# EAGLE design Power Supply board (EAGLE 9.6.2)
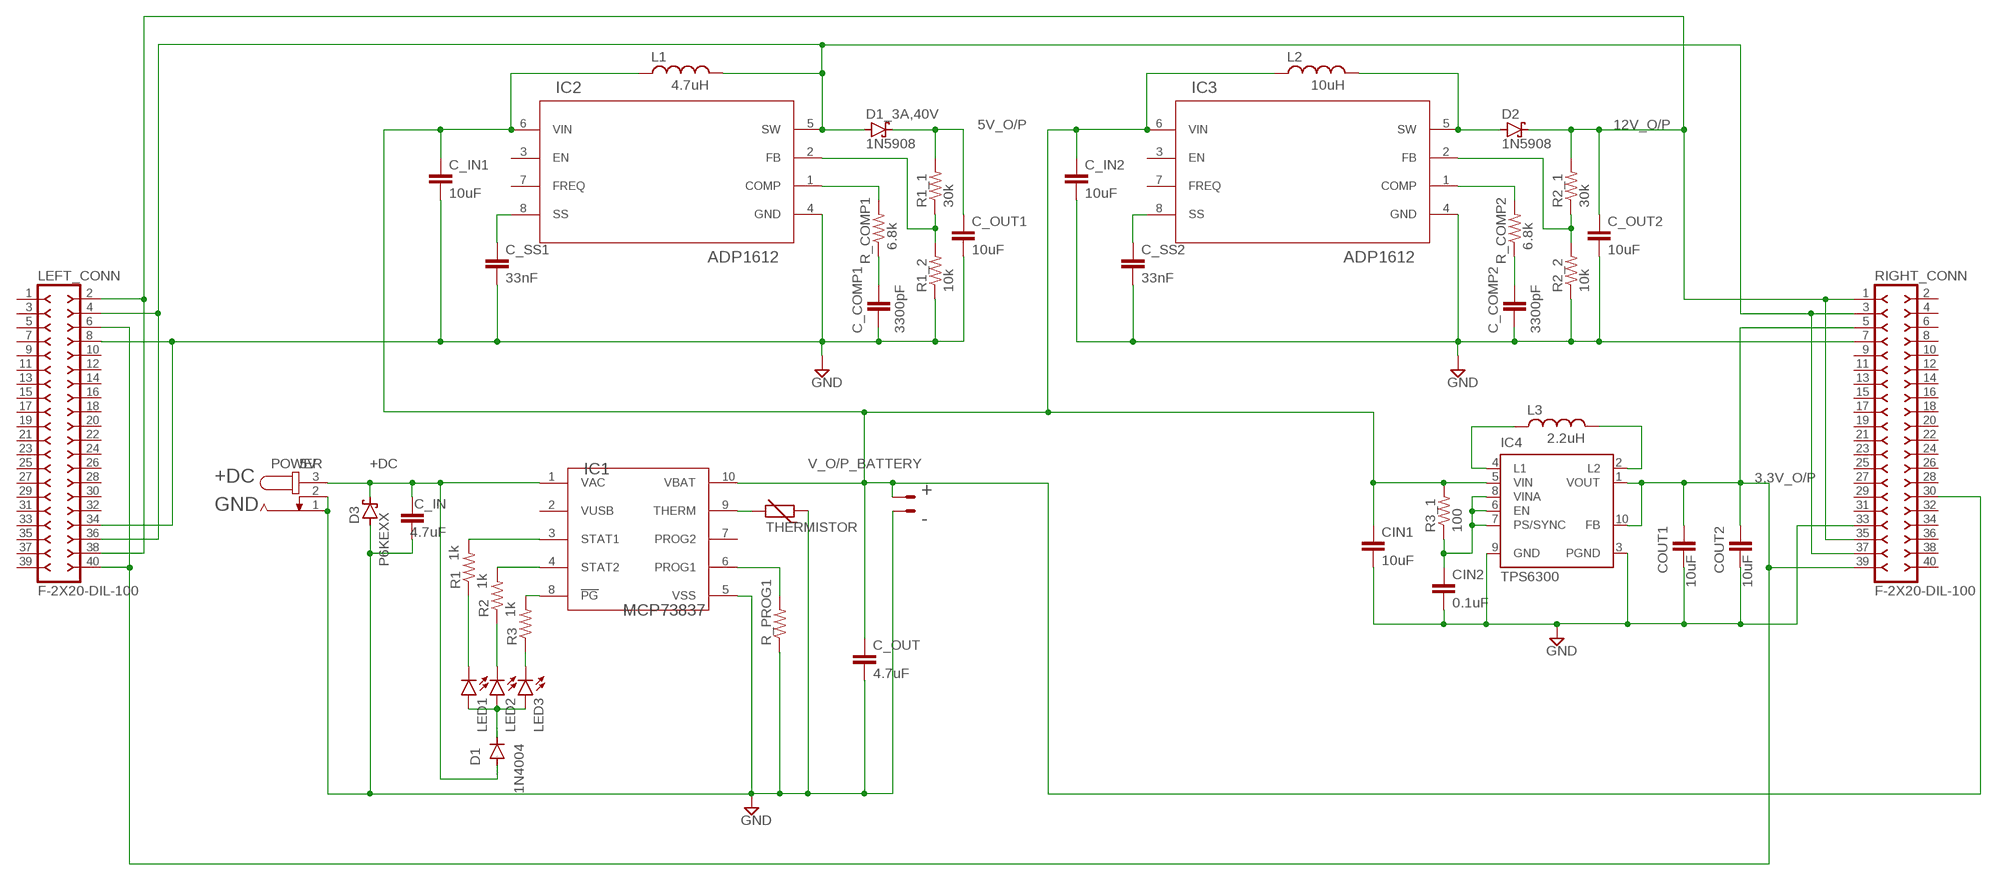
[diagram p0: schematic, sheet 1]

## Parts
BATT-CHARGING  JST-XH-02-PIN-ROUND-PAD  [JST-XH-02-PACKAGE-ROUND-PAD]
C_COMP1  3300pF  C-EU025-024X044  [C025-024X044]
C_COMP2  3300pF  C-EU025-024X044  [C025-024X044]
C_IN  4.7uF  C-EU025-024X044  [C025-024X044]
C_IN1  10uF  C-EU025-024X044  [C025-024X044]
C_IN2  10uF  C-EU025-024X044  [C025-024X044]
C_OUT  4.7uF  C-EU025-024X044  [C025-024X044]
C_OUT1  10uF  C-EU025-024X044  [C025-024X044]
C_OUT2  10uF  C-EU025-024X044  [C025-024X044]
C_SS1  33nF  C-EU025-024X044  [C025-024X044]
C_SS2  33nF  C-EU025-024X044  [C025-024X044]
CIN1  10uF  C-EU025-024X044  [C025-024X044]
CIN2  0.1uF  C-EU025-024X044  [C025-024X044]
COUT1  10uF  C-EU025-024X044  [C025-024X044]
COUT2  10uF  C-EU025-024X044  [C025-024X044]
D1  1N4004  [DO41-10]
D1_3A,40V  1N5908  [C4111-15]
D2  1N5908  [C4111-15]
D3  P6KEXX  [CB417-15]
IC1  MCP73837  MCP73837-FCI/UN  [MSOP10_MC_MCH]
IC2  ADP1612  [RM_8_ADI]
IC3  ADP1612  [RM_8_ADI]
IC4  TPS6300  [DRC-S-PVSON-N10]
L1  4.7uH  L-US0204/7  [0204/7]
L2  10uH  L-US0204/7  [0204/7]
L3  2.2uH  L-US0204/7  [0204/7]
LED1  LED3MM  [LED3MM]
LED2  LED3MM  [LED3MM]
LED3  LED3MM  [LED3MM]
LEFT_CONN  F-2X20-DIL-100  [DIL-100-2X20]
POWER  5V  JACK-PLUG0  [SPC4077]
R1  1k  R-US_0204/7  [0204/7]
R1_1  30k  R-US_0204/7  [0204/7]
R1_2  10k  R-US_0204/7  [0204/7]
R2  1k  R-US_0204/7  [0204/7]
R2_1  30k  R-US_0204/7  [0204/7]
R2_2  10k  R-US_0204/7  [0204/7]
R3  1k  R-US_0204/7  [0204/7]
R3_1  100  R-US_0204/7  [0204/7]
R_COMP1  6.8k  R-US_0204/7  [0204/7]
R_COMP2  6.8k  R-US_0204/7  [0204/7]
R_PROG1  R-US_0204/7  [0204/7]
RIGHT_CONN  F-2X20-DIL-100  [DIL-100-2X20]
THERMISTOR  THERMISTOR-5  [R-5]

## Nets
3.3V_O/P: COUT1.1 COUT2.1 IC4.1(VOUT) IC4.10(FB) LEFT_CONN.6 LEFT_CONN.40 RIGHT_CONN.5 RIGHT_CONN.39
5V_O/P: C_OUT1.1 D1_3A,40V.C R1_1.2
12V_O/P: C_OUT2.1 D2.C LEFT_CONN.2 LEFT_CONN.38 R2_1.2 RIGHT_CONN.1 RIGHT_CONN.35
+DC: C_IN.1 D1.A D3.C IC1.1(VAC) POWER.3
GND: BATT-CHARGING.2 C_COMP1.2 C_COMP2.2 C_IN1.2 C_IN2.2 C_IN.2 C_OUT1.2 C_OUT2.2 C_OUT.2 C_SS1.2 C_SS2.2 CIN1.2 CIN2.2 COUT1.2 COUT2.2 D3.A IC1.5(VSS) IC2.4(GND) IC3.4(GND) IC4.3(PGND) IC4.9(GND) LEFT_CONN.8 LEFT_CONN.34 POWER.1 POWER.2 R1_2.1 R2_2.1 R_PROG1.1 RIGHT_CONN.7 RIGHT_CONN.33 THERMISTOR.1
N$1: IC4.4(L1) L3.1
N$2: D1_3A,40V.A IC2.5(SW) L1.2 LEFT_CONN.4 LEFT_CONN.36 RIGHT_CONN.3 RIGHT_CONN.37
N$4: IC2.2(FB) R1_1.1 R1_2.2
N$5: IC2.1(COMP) R_COMP1.2
N$6: C_COMP1.1 R_COMP1.1
N$7: IC4.2(L2) L3.2
N$8: D2.A IC3.5(SW) L2.2
N$9: IC1.6(PROG1) R_PROG1.2
N$10: IC3.2(FB) R2_1.1 R2_2.2
N$11: C_SS1.1 IC2.8(SS)
N$12: IC3.1(COMP) R_COMP2.2
N$13: C_COMP2.1 R_COMP2.1
N$14: C_SS2.1 IC3.8(SS)
N$15: IC1.3(STAT1) R1.2
N$16: IC1.4(STAT2) R2.2
N$17: CIN2.1 IC4.6(EN) IC4.7(PS/SYNC) IC4.8(VINA) R3_1.1
N$18: IC1.8(!PG) R3.2
N$19: D1.C LED1.A LED2.A LED3.A
N$20: LED1.K(C) R1.1
N$21: LED2.K(C) R2.1
N$22: LED3.K(C) R3.1
N$24: IC1.9(THERM) THERMISTOR.2
V_O/P_BATTERY: BATT-CHARGING.1 C_IN1.1 C_IN2.1 C_OUT.1 CIN1.1 IC1.10(VBAT) IC2.6(VIN) IC3.6(VIN) IC4.5(VIN) L1.1 L2.1 R3_1.2 RIGHT_CONN.30
Unconnected: IC1.2(VUSB) IC1.7(PROG2) IC2.3(EN) IC2.7(FREQ) IC3.3(EN) IC3.7(FREQ) IC4.TH LEFT_CONN.1 LEFT_CONN.3 LEFT_CONN.5 LEFT_CONN.7 LEFT_CONN.9 LEFT_CONN.10 LEFT_CONN.11 LEFT_CONN.12 LEFT_CONN.13 LEFT_CONN.14 LEFT_CONN.15 LEFT_CONN.16 LEFT_CONN.17 LEFT_CONN.18 LEFT_CONN.19 LEFT_CONN.20 LEFT_CONN.21 LEFT_CONN.22 LEFT_CONN.23 LEFT_CONN.24 LEFT_CONN.25 LEFT_CONN.26 LEFT_CONN.27 LEFT_CONN.28 LEFT_CONN.29 LEFT_CONN.30 LEFT_CONN.31 LEFT_CONN.32 LEFT_CONN.33 LEFT_CONN.35 LEFT_CONN.37 LEFT_CONN.39 RIGHT_CONN.2 RIGHT_CONN.4 RIGHT_CONN.6 RIGHT_CONN.8 RIGHT_CONN.9 RIGHT_CONN.10 RIGHT_CONN.11 RIGHT_CONN.12 RIGHT_CONN.13 RIGHT_CONN.14 RIGHT_CONN.15 RIGHT_CONN.16 RIGHT_CONN.17 RIGHT_CONN.18 RIGHT_CONN.19 RIGHT_CONN.20 RIGHT_CONN.21 RIGHT_CONN.22 RIGHT_CONN.23 RIGHT_CONN.24 RIGHT_CONN.25 RIGHT_CONN.26 RIGHT_CONN.27 RIGHT_CONN.28 RIGHT_CONN.29 RIGHT_CONN.31 RIGHT_CONN.32 RIGHT_CONN.34 RIGHT_CONN.36 RIGHT_CONN.38 RIGHT_CONN.40

## Notes on the sheet
- +
- -

## Library data of the parts
BATT-CHARGING = Rembrandt Electronics - JST XH Connectors v1-0:JST-XH-02-PIN: JST XH Connector 2 Pin Wire to board connector. Pitch: 2,54 mm, (0.100") Number of pins: 2 Created by Rembrandt Electronics www.rembrandtelectronics.com
C_COMP1 C_COMP2 C_IN C_IN1 C_IN2 C_OUT C_OUT1 C_OUT2 C_SS1 C_SS2 CIN1 CIN2 COUT1 COUT2 = rcl:C-EU: CAPACITOR, European symbol; SPICEPREFIX: C
D1 = diode:1N4004: DIODE general purpose rectifier, 1 A
D1_3A,40V D2 = diode:1N5908: DIODE schottky
D3 = diode:P6KEXX: DIODE transient-voltage suppressor
IC1 = ultra librarian:MCP73837-FCI/UN: MCP73837 Battery charge controller , MCP 73837 - Li-Ion/Li-Polymer Battery Charge Management Controller; BUILT_BY: EMA_UL_Team; MANUFACTURER_PART_NUMBER: MCP73837-FCI/UN; SOURCELIBRARY: Microchip_2011-05-13; VENDOR: Microchip
IC2 IC3 = ultra librarian:ADP1612: ADP 1612/1613 , ADP 1612, ADP1613, DC - DC step up converter; BUILT_BY: EMA_UL_Team; MANUFACTURER_PART_NUMBER: ADP1612ARMZ-R7; SOURCELIBRARY: Analog_2015-12-15; VENDOR: Analog Devices Inc
IC4 = texas:TPS6300*: HIGH EFFICIENT SINGLE INDUCTOR BUCK-BOOST CONVERTER WITH 1.8-A SWITCHES Source: http://focus.ti.com/lit/ds/symlink/tps63001.pdf; MPN: TPS63000DRCTG4; OC_FARNELL: 1511852; OC_NEWARK: 59M7217
L1-L3 = rcl:L-US: INDUCTOR, American symbol; SPICEPREFIX: L
LED1-LED3 = led:LED: LED OSRAM: - CHIPLED LG R971, LG N971, LY N971, LG Q971, LY Q971, LO R971, LY R971 LH N974, LH R974 LS Q976, LO Q976, LY Q976 LO Q996 - Hyper CHIPLED LW Q18S LB Q993, LB Q99A, LB R99A - SideLED LS A670, LO A670, LY A670, LG A670, LP A670 LB A673, LV A673, LT A673, LW A673 LH A674 LY A675 LS A676, LA A676, LO A676, LY A676, LW A676 LS A679, LY A679, LG A679 - Hyper Micro SIDELED® LS Y876, LA Y876, LO Y876, LY Y876 LT Y87S - SmartLED LW L88C, LW L88S LB L89C, LB L89S, LG L890 LS L89K, LO L89K, LY L89K LS L896, LA L896, LO L896, LY L896 - TOPLED LS T670, LO T670, LY T670, LG T670, LP T670 LSG T670, LSP T670, LSY T670, LOP T670, LYG T670 LG T671, LOG T671, LSG T671 LB T673, LV T673, LT T673, LW T673 LH T674 LS T676, LA T676, LO T676, LY T676, LB T676, LH T676, LSB T676, LW T676 LB T67C, LV T67C, LT T67C, LS T67K, LO T67K, LY T67K, LW E67C LS E67B, LA E67B, LO E67B, LY E67B, LB E67C, LV E67C, LT E67C LW T67C LS T679, LY T679, LG T679 LS T770, LO T770, LY T770, LG T770, LP T770 LB T773, LV T773, LT T773, LW T773 LH T774 LS E675, LA E675, LY E675, LS T675 LS T776, LA T776, LO T776, LY T776, LB T776 LHGB T686 LT T68C, LB T68C - Hyper Mini TOPLED® LB M676 - Mini TOPLED Santana® LG M470 LS M47K, LO M47K, LY M47K Source: http://www.osram.convergy.de LUXEON: - LUMILED® LXK2-PW12-R00, LXK2-PW12-S00, LXK2-PW14-U00, LXK2-PW14-V00 LXK2-PM12-R00, LXK2-PM12-S00, LXK2-PM14-U00 LXK2-PE12-Q00, LXK2-PE12-R00, LXK2-PE12-S00, LXK2-PE14-T00, LXK2-PE14-U00 LXK2-PB12-K00, LXK2-PB12-L00, LXK2-PB12-M00, LXK2-PB14-N00, LXK2-PB14-P00, LXK2-PB14-Q00 LXK2-PR12-L00, LXK2-PR12-M00, LXK2-PR14-Q00, LXK2-PR14-R00 LXK2-PD12-Q00, LXK2-PD12-R00, LXK2-PD12-S00 LXK2-PH12-R00, LXK2-PH12-S00 LXK2-PL12-P00, LXK2-PL12-Q00, LXK2-PL12-R00 Source: www.luxeon.com KINGBRIGHT: KA-3528ASYC Source: www.kingbright.com
LEFT_CONN RIGHT_CONN = con-headers-jp:F-2X20-: FEMALE HEADER
POWER = con-jack:JACK-PLUG: DC POWER JACK Power Jack, DC, Right Angle, Through Hole, Rated 5A at 16VDC, PC Terminals Distributor: Farnell (www.Farnell.de) Drawing: 84N1161.pdf / 84N1162.pdf Manufacturer: SPC Technology (www.spctechnology.com) Type: SPC4077 / SPC 4078; OC_FARNELL: unknown; OC_NEWARK: unknown
R1 R1_1 R1_2 R2 R2_1 R2_2 R3 R3_1 R_COMP1 R_COMP2 R_PROG1 = resistor:R-US_: RESISTOR, American symbol
THERMISTOR = varistor:THERMISTOR: THERMISTOR

## Board
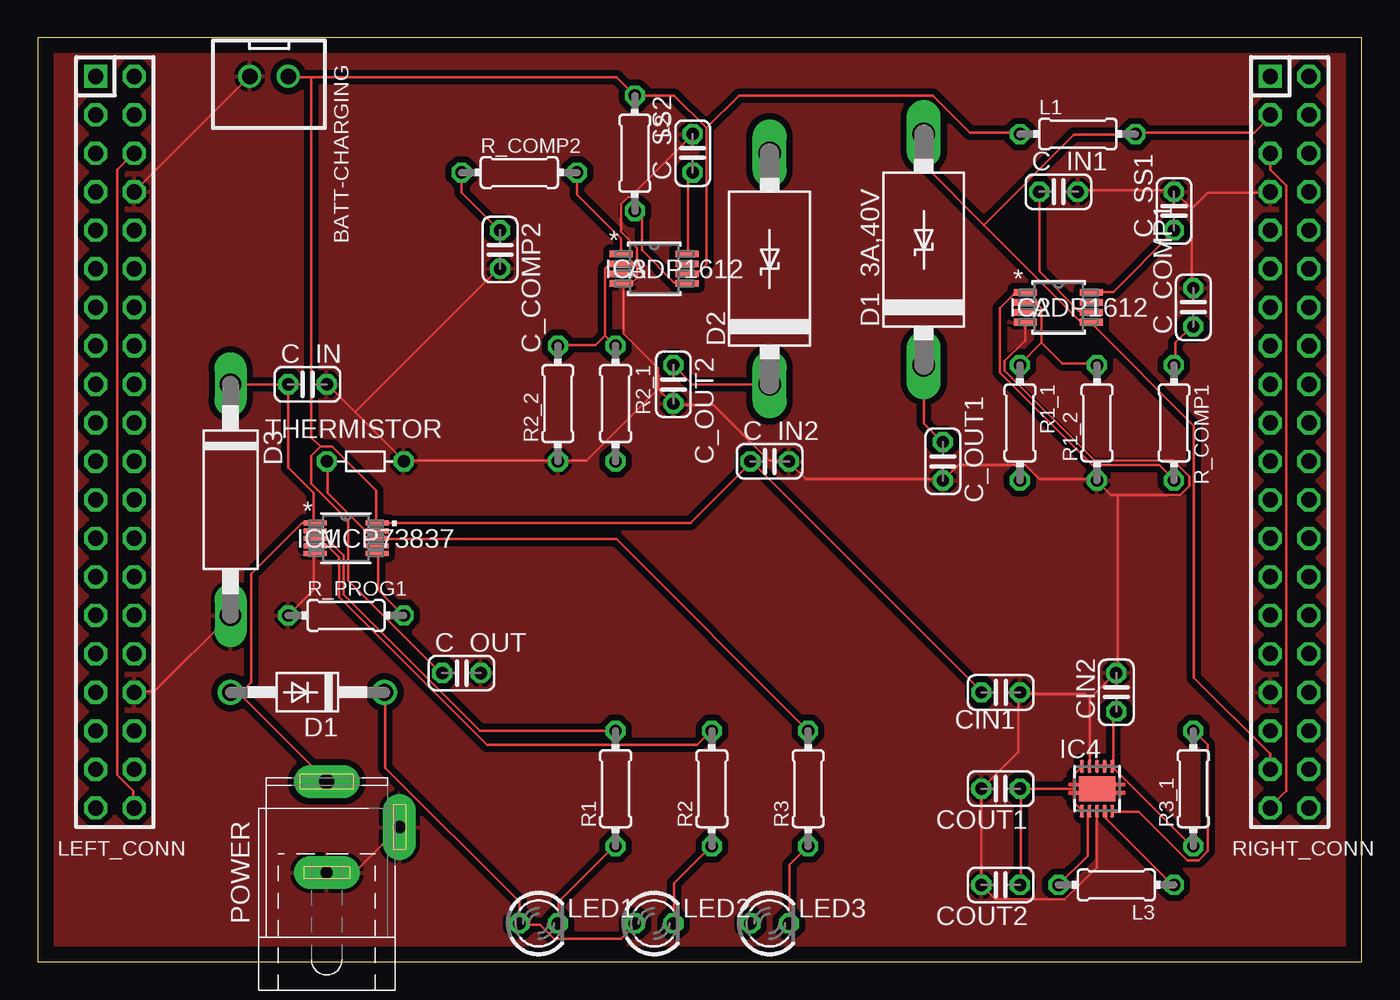
[diagram p1: board, top side]
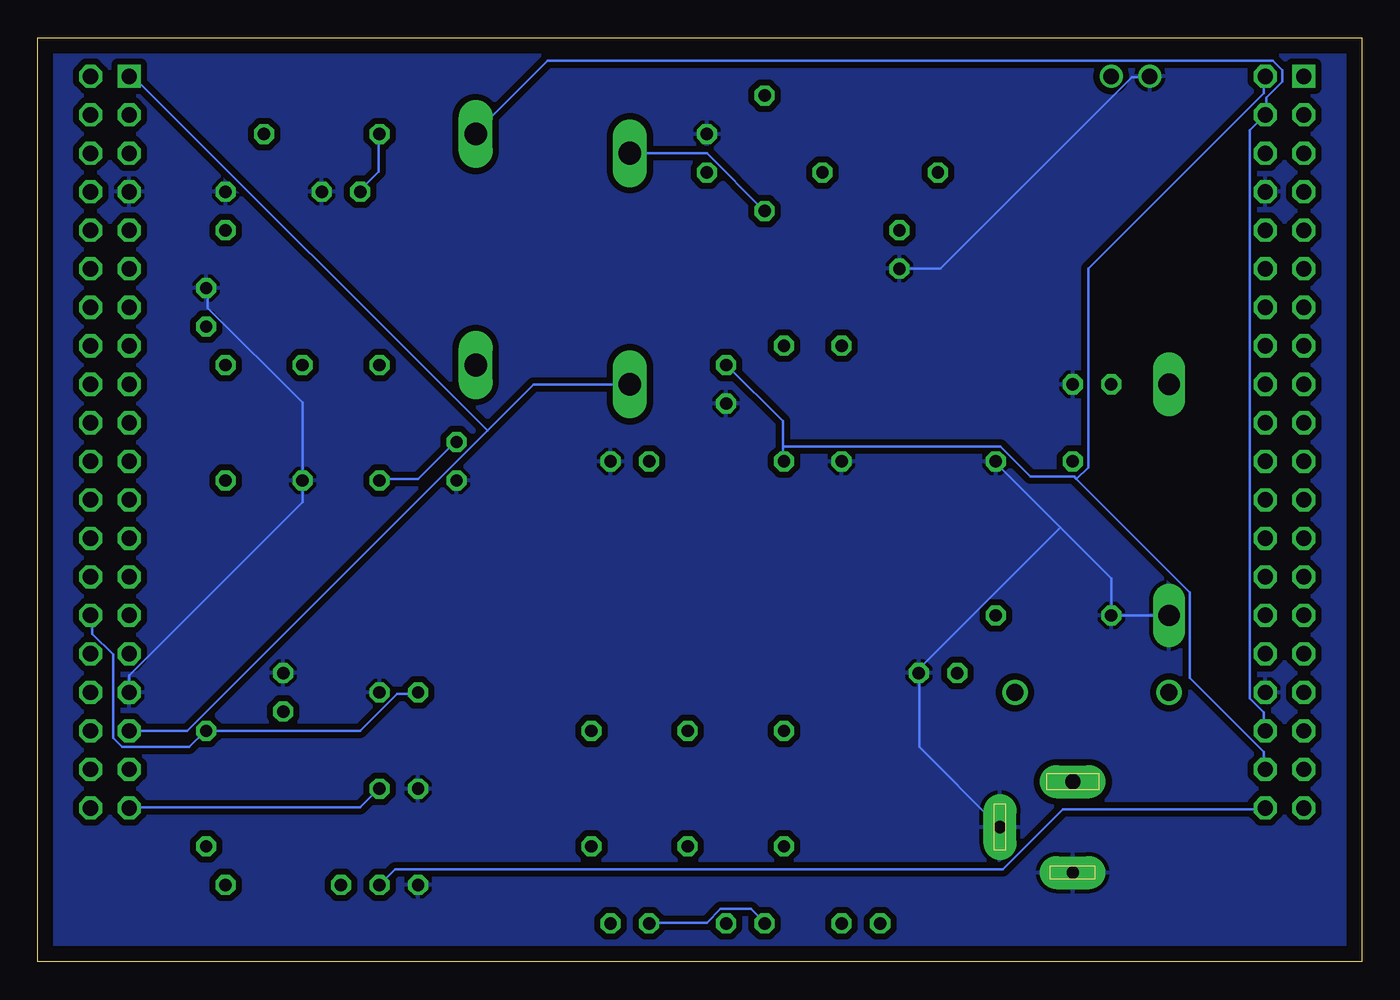
[diagram p2: board, bottom side, seen from below]

Size 87.3 x 60.95 mm. Coordinates in mm from the lower left corner, seen from the top.
Outline: 0,0 87.3,0 87.3,60.95 0,60.95 0,0
Copper layers (1*16): Top 0.035mm / dielectric 1.5mm / Bottom 0.035mm
Design rules "default": minimum track width 6mil, minimum drill 0.35mm, track to track 6mil, track to pad 6mil, pad to pad 6mil, via to via 6mil, smd to smd 6mil, copper to edge 40mil, drill to drill 6mil, minimum pad ring 10mil, minimum via ring 8mil, stop-mask expansion 4mil, vias tented up to drill 0mil, thermal gap 10mil

### Footprints (pad centres in the part's own frame; a part is rotated, then mirrored left to right if it is on the bottom)
JST-XH-02-PACKAGE-ROUND-PAD = drill 1.016: 1 -1.27,0; 2 1.27,0
C025-024X044 = drill 0.813 octagon: 1 -1.27,0; 2 1.27,0
DO41-10 = drill 1.118: A 5.08,0; C -5.08,0
C4111-15 = drill 1.499 long: A 7.62,0; C -7.62,0
CB417-15 = drill 1.397 long: A 7.62,0; C -7.62,0
MSOP10_MC_MCH = smd 1.524 x 0.33: 1 -2.045,1; 2 -2.045,0.5; 3 -2.045,0; 4 -2.045,-0.5; 5 -2.045,-1; 6 2.045,-1; 7 2.045,-0.5; 8 2.045,0; 9 2.045,0.5; 10 2.045,1
RM_8_ADI = smd 1.524 x 0.432: 1 -2.172,0.975; 2 -2.172,0.325; 3 -2.172,-0.325; 4 -2.172,-0.975; 5 2.172,-0.975; 6 2.172,-0.325; 7 2.172,0.325; 8 2.172,0.975
DRC-S-PVSON-N10 = smd 0.28 x 0.85: 1 -1,-1.475; 2 -0.5,-1.475; 3 0,-1.475; 4 0.5,-1.475; 5 1,-1.475; 6 1,1.475; 7 0.5,1.475; 8 0,1.475; 9 -0.5,1.475; 10 -1,1.475 | smd 2.4 x 1.65: TH 0,0
0204/7 = drill 0.813 octagon: 1 -3.81,0; 2 3.81,0
LED3MM = drill 0.813 octagon: A -1.27,0; K 1.27,0
DIL-100-2X20 = drill 1.016 square: 1 -24.13,-1.27 | drill 1.016 octagon: 2 -24.13,1.27; 3 -21.59,-1.27; 4 -21.59,1.27; 5 -19.05,-1.27; 6 -19.05,1.27; 7 -16.51,-1.27; 8 -16.51,1.27; 9 -13.97,-1.27; 10 -13.97,1.27; 11 -11.43,-1.27; 12 -11.43,1.27; 13 -8.89,-1.27; 14 -8.89,1.27; 15 -6.35,-1.27; 16 -6.35,1.27; 17 -3.81,-1.27; 18 -3.81,1.27; 19 -1.27,-1.27; 20 -1.27,1.27; 21 1.27,-1.27; 22 1.27,1.27; 23 3.81,-1.27; 24 3.81,1.27; 25 6.35,-1.27; 26 6.35,1.27; 27 8.89,-1.27; 28 8.89,1.27; 29 11.43,-1.27; 30 11.43,1.27; 31 13.97,-1.27; 32 13.97,1.27; 33 16.51,-1.27; 34 16.51,1.27; 35 19.05,-1.27; 36 19.05,1.27; 37 21.59,-1.27; 38 21.59,1.27; 39 24.13,-1.27; 40 24.13,1.27
SPC4077 = drill 0.8 pad 2.184 long: 1 -3,0; 2 0,-4.8 | drill 1 pad 2.184 long: 3 3,0
R-5 = drill 0.813 octagon: 1 -2.54,0; 2 2.54,0

### Placement (x,y rotation side)
BATT-CHARGING  15.24,58.42 180 top
C_COMP1  76.2,43.18 90 top
C_COMP2  30.48,46.99 270 top
C_IN  17.78,38.1 0 top
C_IN1  67.31,50.8 0 top
C_IN2  48.26,33.02 0 top
C_OUT  27.94,19.05 0 top
C_OUT1  59.69,33.02 270 top
C_OUT2  41.91,38.1 270 top
C_SS1  74.93,49.53 90 top
C_SS2  43.18,53.34 90 top
CIN1  63.5,17.78 0 top
CIN2  71.12,17.78 90 top
COUT1  63.5,11.43 180 top
COUT2  63.5,5.08 180 top
D1  17.78,17.78 180 top
D1_3A,40V  58.42,46.99 90 top
D2  48.26,45.72 90 top
D3  12.7,30.48 270 top
IC1  20.32,27.94 0 top
IC2  67.31,43.18 0 top
IC3  40.64,45.72 0 top
IC4  69.85,11.43 0 top
L1  68.58,54.61 0 top
L2  39.37,53.34 270 top
L3  71.12,5.08 180 top
LED1  33.02,2.54 0 top
LED2  40.64,2.54 0 top
LED3  48.26,2.54 0 top
LEFT_CONN  5.08,34.29 270 top
POWER  19.05,8.89 90 top
R1  38.1,11.43 90 top
R1_1  64.77,35.56 270 top
R1_2  69.85,35.56 90 top
R2  44.45,11.43 90 top
R2_1  38.1,36.83 270 top
R2_2  34.29,36.83 90 top
R3  50.8,11.43 90 top
R3_1  76.2,11.43 90 top
R_COMP1  74.93,35.56 270 top
R_COMP2  31.75,52.07 0 top
R_PROG1  20.32,22.86 0 top
RIGHT_CONN  82.55,34.29 270 top
THERMISTOR  21.59,33.02 180 top

### Tracks (layer width: path | path; a pad name or v marks a point on that pad's centre or on a via)
3.3V_O/P
  Top 0.152: LEFT_CONN.40 6.3,10.21 6.3,11.28 5.23,12.34 5.23,52.27 6.3,53.34 LEFT_CONN.6 | 68.33,11.43 68.33,12.34 68.78,12.8 IC4.10 | 68.33,11.43 68.33,10.52 68.78,10.06 IC4.1 | 64.82,11.43 68.33,11.43 | 64.82,11.43 64.82,5.18 COUT2.1 | 64.82,11.43 COUT1.1 | RIGHT_CONN.5 81.28,52.27 82.35,51.21 82.35,11.28 81.28,10.21 RIGHT_CONN.39
  Bottom 0.152: RIGHT_CONN.39 81.28,10.21 66.04,10.21 64.82,11.43 COUT1.1 | COUT2.1 63.75,6.1 23.67,6.1 19.71,10.06 6.45,10.06 LEFT_CONN.40
5V_O/P
  Top 0.152: D1_3A,40V.C 58.42,35.51 59.64,34.29 C_OUT1.1
  Bottom 0.152: R1_1.2 64.67,31.85 62.23,31.85 59.79,34.29 C_OUT1.1
12V_O/P
  Top 0.152: D2.C 43.18,38.1 C_OUT2.1
  Bottom 0.152: RIGHT_CONN.35 77.47,15.24 57.66,35.05 | 57.66,35.05 54.61,38.1 D2.C | 57.66,35.05 80.98,58.37 81.28,58.37 RIGHT_CONN.1 | 38.15,33.98 38.15,35.66 41.81,39.32 C_OUT2.1 | 38.15,33.98 38.15,33.07 R2_1.2 | 18.8,31.85 18.95,32 21.84,32 23.83,33.98 38.15,33.98 | 18.8,31.85 11.33,24.38 11.33,18.75 6.45,13.87 6.45,12.8 LEFT_CONN.38 | 18.8,31.85 18.03,32.61 18.03,45.72 6.45,57.3 6.45,58.37 LEFT_CONN.2
+DC
  Top 0.152: 18.19,28.96 18.19,30.94 16.51,32.61 C_IN.1 D3.C | 13.31,17.68 12.7,17.68 D1.A 13.31,17.68 | 13.31,17.68 18.95,12.04 POWER.3 | 18.19,28.96 17.42,28.96 14.07,25.6 14.07,18.44 13.31,17.68 | 18.19,28.96 IC1.1
GND
  Top 0.152: 69.39,17.37 69.39,12.95 IC4.9 | 69.39,17.37 71.07,19.05 CIN2.2 71.22,19.05 71.22,30.79 | 69.39,17.37 69.09,17.68 64.82,17.68 CIN1.2 64.67,17.68 64.67,13.87 COUT1.2 COUT2.2 62.23,5.03 63.14,4.12 67.72,4.12 69.85,6.25 IC4.3 | C_IN1.2 68.63,50.9 74.88,50.9 C_SS1.2 75.03,50.75 76.1,49.68 | 76.1,49.68 76.1,44.5 C_COMP1.2 | 76.1,49.68 77.17,50.75 81.28,50.75 RIGHT_CONN.7 | 71.22,30.79 70.76,30.79 69.85,31.7 R1_2.1 69.85,31.85 66.04,31.85 65.13,32.77 60.71,32.77 C_OUT1.2 59.64,31.85 50.65,31.85 49.58,32.92 C_IN2.2 49.43,33.07 48.21,33.07 44.55,36.73 41.96,36.73 C_OUT2.2 41.81,36.88 40.89,37.8 | 71.22,30.79 75.34,30.79 75.95,31.39 75.95,32 74.88,33.07 69.7,33.07 63.75,39.01 63.75,39.62 65.13,41 65.13,42.06 IC2.4 | 40.89,37.8 40.89,39.17 38.61,41.45 38.61,44.65 IC3.4 38.61,44.81 39.22,44.81 39.52,45.11 39.52,47.09 38.46,48.16 38.46,49.99 38.91,50.44 39.06,50.44 43.18,54.56 C_SS2.2 | 40.89,37.8 36.17,33.07 34.34,33.07 R2_2.1 34.19,33.07 24.13,33.07 | POWER.1 19.1,5.94 20.93,5.94 23.83,8.84 POWER.2 | R_PROG1.1 18.19,24.54 18.19,26.82 IC1.5 | D3.A 7.67,17.83 6.45,17.83 LEFT_CONN.34 | BATT-CHARGING.2 LEFT_CONN.8 | 20.93,36.27 19.1,38.1 C_IN.2 | 20.93,36.27 24.13,33.07 | 20.93,36.27 30.38,45.72 C_COMP2.2 | 24.13,33.07 THERMISTOR.1
  Bottom 0.152: RIGHT_CONN.33 81.28,18.9 69.85,30.33 R1_2.1 69.85,36.88 76.1,43.13 76.1,44.35 C_COMP1.2 | 29.16,19.05 29.16,14.17 23.98,8.99 POWER.2 | D3.A R_PROG1.1 16.51,25.3 19.86,28.65 | C_COMP2.2 27.79,45.72 15.14,58.37 14.07,58.37 BATT-CHARGING.2 | 19.86,28.65 24.13,32.92 THERMISTOR.1 | 29.16,19.05 29.16,19.36 19.86,28.65 | 29.16,19.05 C_OUT.2
  pour Top (isolate 0.406): 0,60.96 87.63,60.96 87.63,0 0,0
  pour Bottom (isolate 0.406): 0,60.96 87.63,60.96 87.63,0 0,0
N$1
  Top 0.152: IC4.4 70.46,9.91 70.46,9.45 74.88,5.03 L3.1
N$2
  Top 0.152: RIGHT_CONN.3 81.28,55.78 80.21,54.71 72.44,54.71 L1.2 72.29,54.56 68.33,54.56 62.38,48.62 | 62.38,48.62 58.42,52.58 D1_3A,40V.A | 62.38,48.62 68.78,42.22 69.39,42.22 IC2.5 69.55,42.06 76.25,35.36 76.25,18.75 81.28,13.72 RIGHT_CONN.37
  Bottom 0.152: LEFT_CONN.36 6.45,15.24 6.45,16.46 7.37,17.37 7.37,54.86 LEFT_CONN.4 6.3,55.93 6.3,57 5.23,58.06 5.23,58.83 5.84,59.44 53.7,59.44 58.42,54.71 D1_3A,40V.A
N$4
  Top 0.152: 66.19,40.84 66.19,43.13 65.89,43.43 65.28,43.43 IC2.2 | 66.19,40.84 64.82,39.47 R1_1.1 | 66.19,40.84 67.56,39.47 69.85,39.47 R1_2.2
N$5
  Top 0.152: IC2.1 65.13,44.04 64.36,44.04 63.45,43.13 63.45,38.86 69.55,32.77 73.97,32.77 74.88,31.85 R_COMP1.2
N$6
  Top 0.152: R_COMP1.1 75.03,39.47 75.03,40.84 76.1,41.91 C_COMP1.1
N$7
  Top 0.152: L3.2 69.24,7.01 69.24,9.91 IC4.2
N$8
  Top 0.152: L2.2 39.83,49.07 39.83,46.94 41.96,44.81 42.72,44.81 IC3.5
  Bottom 0.152: D2.A 43.18,53.34 L2.2
N$9
  Top 0.152: R_PROG1.2 22.45,24.54 22.45,26.82 IC1.6
N$10
  Top 0.152: 37.39,41.3 37.39,45.72 37.69,46.02 38.46,46.02 IC3.2 | 37.39,41.3 38,40.69 R2_1.1 | 37.39,41.3 36.78,40.69 34.34,40.69 R2_2.2
N$11
  Top 0.152: IC2.8 69.55,44.2 70.92,44.2 74.88,48.16 C_SS1.1
N$12
  Top 0.152: R_COMP2.2 35.56,50.6 38.46,47.7 38.46,46.79 IC3.1
N$13
  Top 0.152: R_COMP2.1 27.94,50.75 30.38,48.31 C_COMP2.1
N$14
  Top 0.152: IC3.8 42.88,46.79 42.88,51.66 43.18,51.97 C_SS2.1
N$15
  Top 0.152: R1.2 29.16,15.24 20.17,24.23 20.17,26.82 19.1,27.89 18.34,27.89 IC1.3
N$16
  Top 0.152: IC1.4 18.34,27.43 19.1,27.43 19.86,26.67 19.86,24.08 29.62,14.33 43.48,14.33 44.4,15.24 R2.2
N$17
  Top 0.152: IC4.8 69.85,12.95 70.31,12.95 IC4.7 70.46,12.95 70.76,12.95 IC4.6 | CIN2.1 70.92,16.31 70.92,12.95 IC4.6 | R3_1.1 76.1,7.62 70.92,12.8 IC4.6
N$18
  Top 0.152: R3.2 38.15,27.89 22.45,27.89 IC1.8
N$19
  Top 0.152: LED2.A 39.37,2.44 38.46,1.52 34.04,1.52 33.12,2.44 31.75,2.44 LED1.A 31.75,3.96 22.91,12.8 22.91,17.68 D1.C
  Bottom 0.152: LED3.A 46.99,2.59 43.18,2.59 42.27,3.5 40.28,3.5 39.37,2.59 LED2.A
N$20
  Top 0.152: LED1.K 34.34,2.59 34.34,3.96 38,7.62 R1.1
N$21
  Top 0.152: LED2.K 41.96,2.59 41.96,5.18 44.4,7.62 R2.1
N$22
  Top 0.152: R3.1 49.58,6.4 49.58,2.59 LED3.K
N$24
  Top 0.152: IC1.9 22.3,28.5 21.54,28.5 19.1,30.94 19.1,32.92 THERMISTOR.2
V_O/P_BATTERY
  Top 0.152: C_IN1.1 66.04,45.57 68.63,42.98 69.39,42.98 IC2.6 | 44.09,55.02 44.09,46.02 43.48,45.41 42.88,45.41 IC3.6 | 44.09,55.02 41.96,57.15 L2.1 38.15,58.37 18.03,58.37 | 18.03,58.37 16.51,58.37 BATT-CHARGING.1 | 44.09,55.02 46.23,57.15 59.03,57.15 61.47,54.71 64.67,54.71 L1.1 | IC4.5 70.92,9.91 72.59,9.91 75.79,6.71 76.56,6.71 77.17,7.32 77.17,14.33 76.25,15.24 R3_1.2 | 18.64,33.98 18.03,33.38 18.03,31.55 20.47,29.11 20.47,25.15 26.57,19.05 C_OUT.1 | 18.64,33.98 19.41,33.98 22.3,31.09 22.3,28.96 IC1.10 22.45,28.96 43.03,28.96 46.99,32.92 C_IN2.1 46.99,33.07 62.23,17.83 CIN1.1 | 18.03,58.37 18.03,34.59 18.64,33.98
  Bottom 0.152: L1.1 64.82,54.56 64.82,52.12 66.04,50.9 C_IN1.1 | CIN1.1 62.23,17.68 63.6,17.68 66.04,15.24 R3_1.2 76.25,15.24 77.32,14.17 81.74,14.17 82.35,14.78 82.35,20.27 83.72,21.64 83.72,22.86 RIGHT_CONN.30

### Text on the board
Reference: 12V | 5V | 3.3V | BATTERY CHARGING